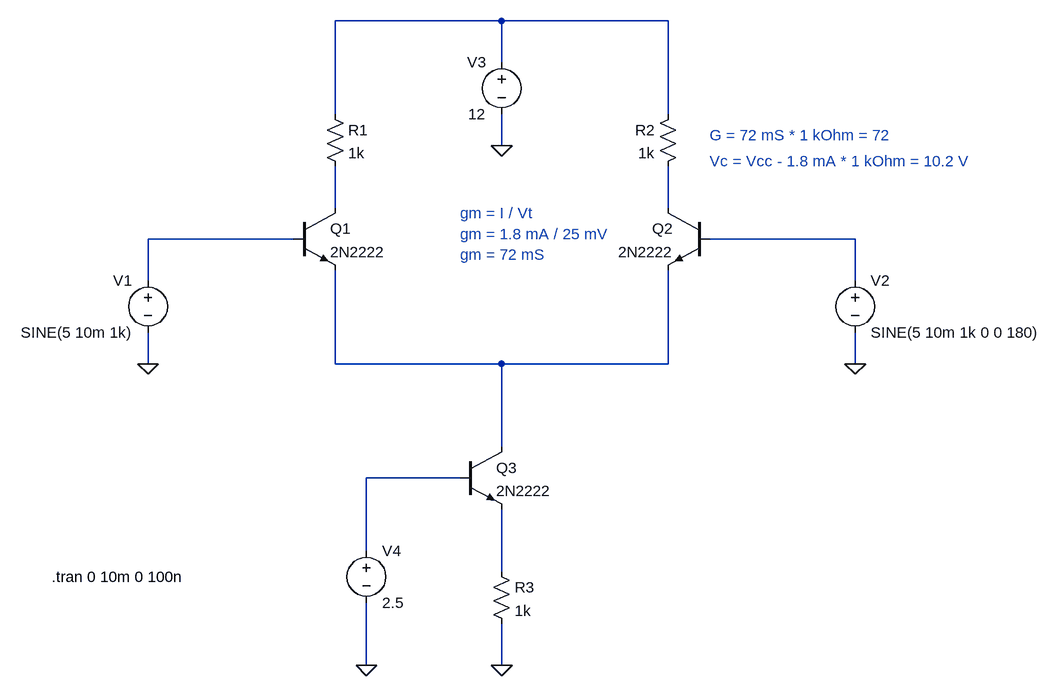
[diagram p0: schematic org_sema.asc]
org_sema.asc, the LTspice schematic file:
Version 4
SHEET 1 1124 820
WIRE 272 -192 16 -192
WIRE 528 -192 272 -192
WIRE 272 -128 272 -192
WIRE 16 -48 16 -192
WIRE 528 -48 528 -192
WIRE 272 0 272 -48
WIRE 16 96 16 32
WIRE 528 96 528 32
WIRE -48 144 -272 144
WIRE 816 144 592 144
WIRE -272 208 -272 144
WIRE 816 208 816 144
WIRE -272 336 -272 288
WIRE 16 336 16 192
WIRE 272 336 16 336
WIRE 528 336 528 192
WIRE 528 336 272 336
WIRE 816 336 816 288
WIRE 272 464 272 336
WIRE 208 512 64 512
WIRE 64 624 64 512
WIRE 272 656 272 560
WIRE 64 800 64 704
WIRE 272 800 272 736
FLAG -272 336 0
FLAG 816 336 0
FLAG 272 0 0
FLAG 272 800 0
FLAG 64 800 0
SYMBOL npn -48 96 R0
SYMATTR InstName Q1
SYMATTR Value 2N2222
SYMBOL res 0 -64 R0
SYMATTR InstName R1
SYMATTR Value 1k
SYMBOL voltage -272 192 M0
WINDOW 123 0 0 Left 0
WINDOW 39 0 0 Left 0
SYMATTR InstName V1
SYMATTR Value SINE(5 10m 1k)
SYMBOL npn 592 96 M0
SYMATTR InstName Q2
SYMATTR Value 2N2222
SYMBOL res 544 -64 M0
SYMATTR InstName R2
SYMATTR Value 1k
SYMBOL voltage 816 192 R0
WINDOW 123 0 0 Left 0
WINDOW 39 0 0 Left 0
SYMATTR InstName V2
SYMATTR Value SINE(5 10m 1k 0 0 180)
SYMBOL voltage 272 -144 M0
WINDOW 123 0 0 Left 0
WINDOW 39 0 0 Left 0
SYMATTR InstName V3
SYMATTR Value 12
SYMBOL res 256 640 R0
SYMATTR InstName R3
SYMATTR Value 1k
SYMBOL npn 208 464 R0
SYMATTR InstName Q3
SYMATTR Value 2N2222
SYMBOL voltage 64 608 R0
WINDOW 123 0 0 Left 0
WINDOW 39 0 0 Left 0
SYMATTR InstName V4
SYMATTR Value 2.5
TEXT -420 664 Left 2 !.tran 0 10m 0 100n
TEXT 208 136 Left 2 ;gm = 1.8 mA / 25 mV
TEXT 208 168 Left 2 ;gm = 72 mS
TEXT 592 -16 Left 2 ;G = 72 mS * 1 kOhm = 72
TEXT 592 24 Left 2 ;Vc = Vcc - 1.8 mA * 1 kOhm = 10.2 V
TEXT 208 104 Left 2 ;gm = I / Vt

The netlist it stands for:
* org_sema.asc
Q1 N002 N004 N006 0 2N2222
R1 N001 N002 1k
V1 N004 0 SINE(5 10m 1k)
Q2 N003 N005 N006 0 2N2222
R2 N001 N003 1k
V2 N005 0 SINE(5 10m 1k 0 0 180)
V3 N001 0 12
R3 N008 0 1k
Q3 N006 N007 N008 0 2N2222
V4 N007 0 2.5
.model NPN NPN
.model PNP PNP
.lib standard.bjt
.tran 0 10m 0 100n
* gm = 1.8 mA / 25 mV
* gm = 72 mS
* G = 72 mS * 1 kOhm = 72
* Vc = Vcc - 1.8 mA * 1 kOhm = 10.2 V
* gm = I / Vt
.backanno
.end